# EAGLE schematic breakout_rfm12b (EAGLE 5.11)
ABBREV: jn5; PROJECT: JeeNode v5
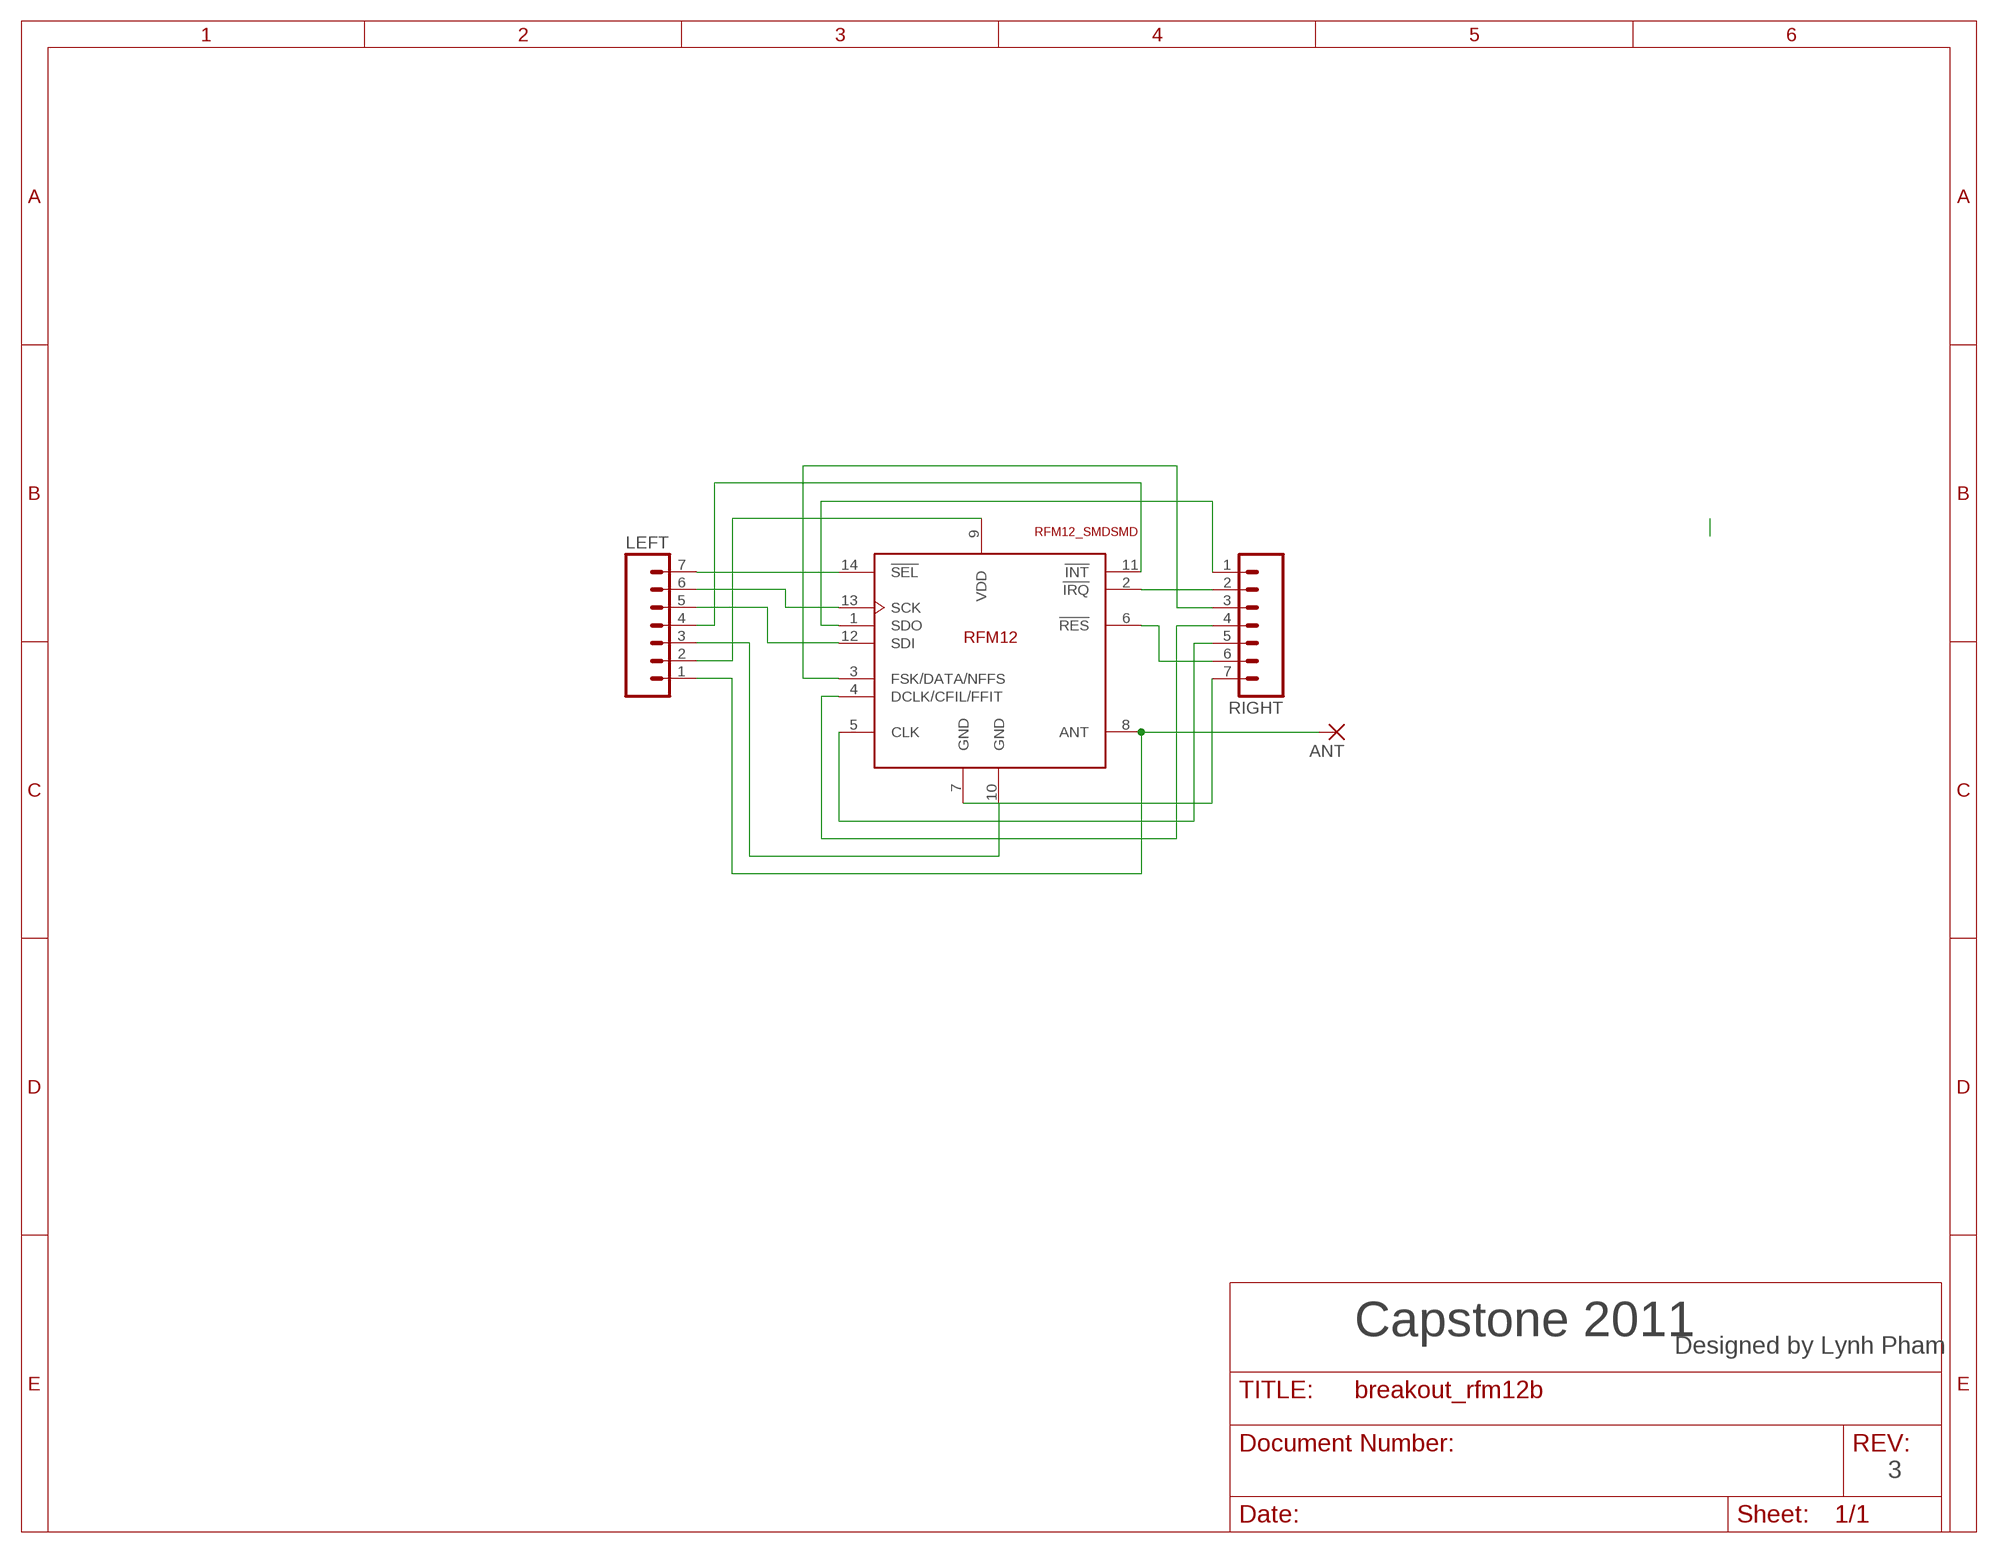
[diagram p0: schematic, sheet 1]

## Parts
ANT  1,6/0,8  [1,6/0,8]
LEFT  M07  [1X07]
RIGHT  M07  [1X07]
U$1  RFM12_SMDSMD  [RFM12]

## Nets
N$2: LEFT.7 U$1.14(!SEL)
N$3: LEFT.6 U$1.13(SCK)
N$4: LEFT.5 U$1.12(SDI)
N$5: LEFT.3 U$1.10(GND)
N$6: ANT.1(P) LEFT.1 U$1.8(ANT)
N$7: RIGHT.1 U$1.1(SDO)
N$8: RIGHT.2 U$1.2(!IRQ)
N$9: RIGHT.7 U$1.7(GND)
N$10: LEFT.4 U$1.11(!INT)
N$11: RIGHT.6 U$1.6(!RES)
N$12: RIGHT.5 U$1.5(CLK)
N$13: RIGHT.4 U$1.4(DCLK/CFIL/FFIT)
N$14: RIGHT.3 U$1.3(FSK/DATA/NFFS)
VDD: LEFT.2 U$1.9(VDD)

## Notes on the sheet
- Capstone 2011
- Designed by Lynh Pham
- 3

## Library data of the parts
ANT = wirepad:1,6/0,8: THROUGH-HOLE PAD
LEFT RIGHT = M7_02mm:M07: Header 7 Standard 7-pin 0.1" header. Use with straight break away headers (SKU : PRT-00116), right angle break away headers (PRT-00553), swiss pins (PRT-00743), machine pins (PRT-00117), and female headers (PRT-00115). NOTES ON THE VARIANTS LOCK and LOCK_LONGPADS... This footprint was designed to help hold the alignment of a through-hole component (i.e. 7-pin header) while soldering it into place. You may notice that each hole has been shifted either up or down by 0.005 of an inch from it's more standard position (which is usually a perfectly straight line). This slight alteration caused the pins (the squares in the middle) to touch the edges of the holes. Because they are alternating, it causes a "brace" to hold the header in place. 0.005 has proven to be the perfect amount of "off-center" position when using our standard breakaway headers. Although looks a little odd when you look at the bare footprint, once you have a header in there, the alteration is very hard to notice. Also, if you push a header all the way into place, it is covered up entirely on the bottom side. This idea of altering the position of holes to aid alignment will be further integrated into the Sparkfun Library for other footprints. It can help hold any component with 3 or more connection pins.
U$1 = rfm_12:RFM12_SMD: RFM12 is a low costing ISM band transceiver module implemented with unique PLL. It works signal ranges from 315/433/868/915MHZ bands, comply with FCC, ETSI regulation. The SPI interface is used to communicate with microcontroller for parameter setting.

## Net classes
1 power: width 0.381 mm, clearance 0.254 mm